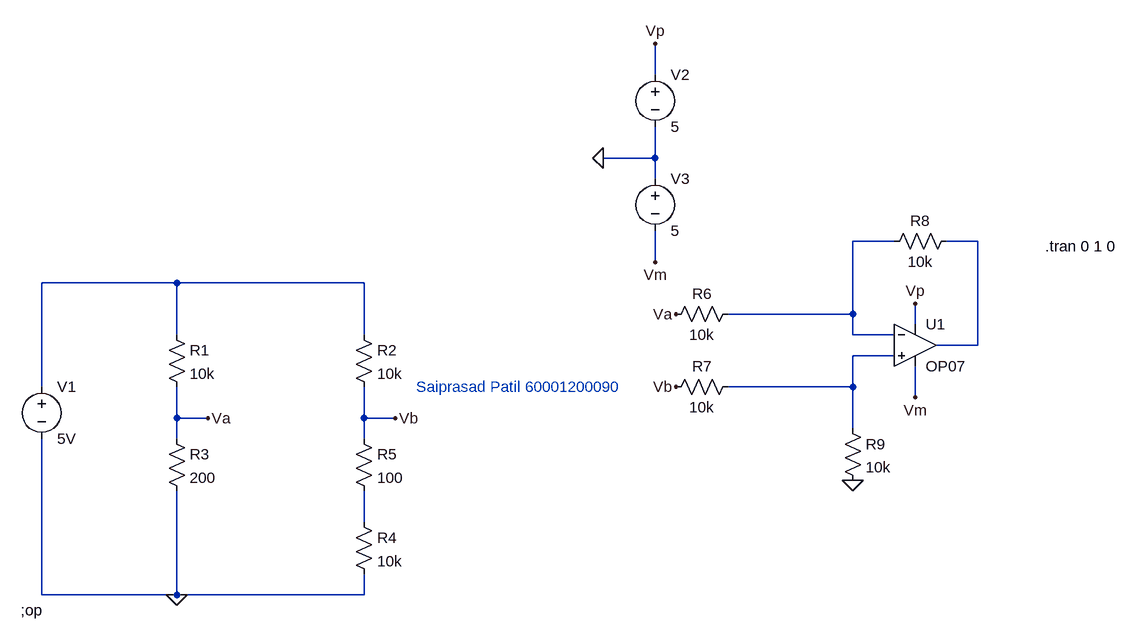
[diagram p0: schematic exp6b.asc]
exp6b.asc, the LTspice schematic file:
Version 4
SHEET 1 1732 680
WIRE 1008 -352 1008 -400
WIRE 1008 -224 1008 -272
WIRE 1008 -224 928 -224
WIRE 1008 -192 1008 -224
WIRE 1376 -96 1312 -96
WIRE 1504 -96 1456 -96
WIRE 1008 -64 1008 -112
WIRE 272 -32 64 -32
WIRE 560 -32 272 -32
WIRE 1312 16 1312 -96
WIRE 1312 16 1120 16
WIRE 1408 32 1408 0
WIRE 272 48 272 -32
WIRE 560 48 560 -32
WIRE 1312 48 1312 16
WIRE 1376 48 1312 48
WIRE 1504 64 1504 -96
WIRE 1504 64 1440 64
WIRE 1376 80 1312 80
WIRE 64 128 64 -32
WIRE 1312 128 1312 80
WIRE 1312 128 1120 128
WIRE 1408 144 1408 96
WIRE 272 176 272 128
WIRE 320 176 272 176
WIRE 560 176 560 128
WIRE 608 176 560 176
WIRE 1312 192 1312 128
WIRE 272 208 272 176
WIRE 560 208 560 176
WIRE 560 336 560 288
WIRE 64 448 64 208
WIRE 272 448 272 288
WIRE 272 448 64 448
WIRE 560 448 560 416
WIRE 560 448 272 448
FLAG 272 448 0
FLAG 320 176 Va
FLAG 608 176 Vb
FLAG 1040 16 Va
FLAG 1040 128 Vb
FLAG 1408 0 Vp
FLAG 1408 144 Vm
FLAG 1312 272 0
FLAG 928 -224 0
FLAG 1008 -400 Vp
FLAG 1008 -64 Vm
SYMBOL voltage 64 112 R0
WINDOW 123 0 0 Left 0
WINDOW 39 0 0 Left 0
SYMATTR InstName V1
SYMATTR Value 5V
SYMBOL res 256 32 R0
SYMATTR InstName R1
SYMATTR Value 10k
SYMBOL res 544 32 R0
SYMATTR InstName R2
SYMATTR Value 10k
SYMBOL res 256 192 R0
SYMATTR InstName R3
SYMATTR Value 200
SYMBOL res 544 320 R0
SYMATTR InstName R4
SYMATTR Value 10k
SYMBOL res 544 192 R0
SYMATTR InstName R5
SYMATTR Value 100
SYMBOL res 1136 0 R90
WINDOW 0 0 56 VBottom 2
WINDOW 3 32 56 VTop 2
SYMATTR InstName R6
SYMATTR Value 10k
SYMBOL res 1136 112 R90
WINDOW 0 0 56 VBottom 2
WINDOW 3 32 56 VTop 2
SYMATTR InstName R7
SYMATTR Value 10k
SYMBOL OpAmps\\OP07 1408 0 R0
SYMATTR InstName U1
SYMBOL res 1472 -112 R90
WINDOW 0 0 56 VBottom 2
WINDOW 3 32 56 VTop 2
SYMATTR InstName R8
SYMATTR Value 10k
SYMBOL res 1296 176 R0
SYMATTR InstName R9
SYMATTR Value 10k
SYMBOL voltage 1008 -368 R0
WINDOW 123 0 0 Left 0
WINDOW 39 0 0 Left 0
SYMATTR InstName V2
SYMATTR Value 5
SYMBOL voltage 1008 -208 R0
WINDOW 123 0 0 Left 0
WINDOW 39 0 0 Left 0
SYMATTR InstName V3
SYMATTR Value 5
TEXT 32 472 Left 2 !;op
TEXT 640 128 Left 2 ;Saiprasad Patil 60001200090
TEXT 1608 -88 Left 2 !.tran 0 1 0

The netlist it stands for:
* exp6b.asc
V1 N003 0 5V
R1 N003 Va 10k
R2 N003 Vb 10k
R3 Va 0 200
R4 N005 0 10k
R5 Vb N005 100
R6 N001 Va 10k
R7 N004 Vb 10k
XU1 N004 N001 Vp Vm N002 LT1001  ; OP07, pins In+ In- V+ V- OUT
R8 N002 N001 10k
R9 N004 0 10k
V2 Vp 0 5
V3 0 Vm 5
;op
* Saiprasad Patil 60001200090
.tran 0 1 0
.lib LTC.lib
.backanno
.end